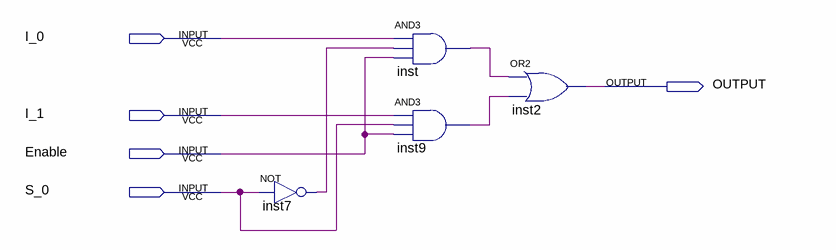
[diagram p0: schematic sheet]
// Quartus schematic 2_1_MUX.bdf as structural Verilog: 4 symbols, 5 pins
module \2_1_MUX  (
  input  I_0,
  input  I_1,
  input  Enable,
  input  S_0,
  output OUTPUT
);

  wire inst7_out, inst9_out, inst_out;

  not inst7 (inst7_out, S_0);
  and inst (inst_out, I_0, inst7_out, Enable);
  and inst9 (inst9_out, I_1, S_0, Enable);
  or inst2 (OUTPUT, inst_out, inst9_out);
endmodule
